# EasyEDA schematic SCH_Schema Sensoren_2022-11-04.json
TITLE: Sheet_1; REV: 1.0; Date: 2022-11-04; Sheet: 1/1; Company: Your Company
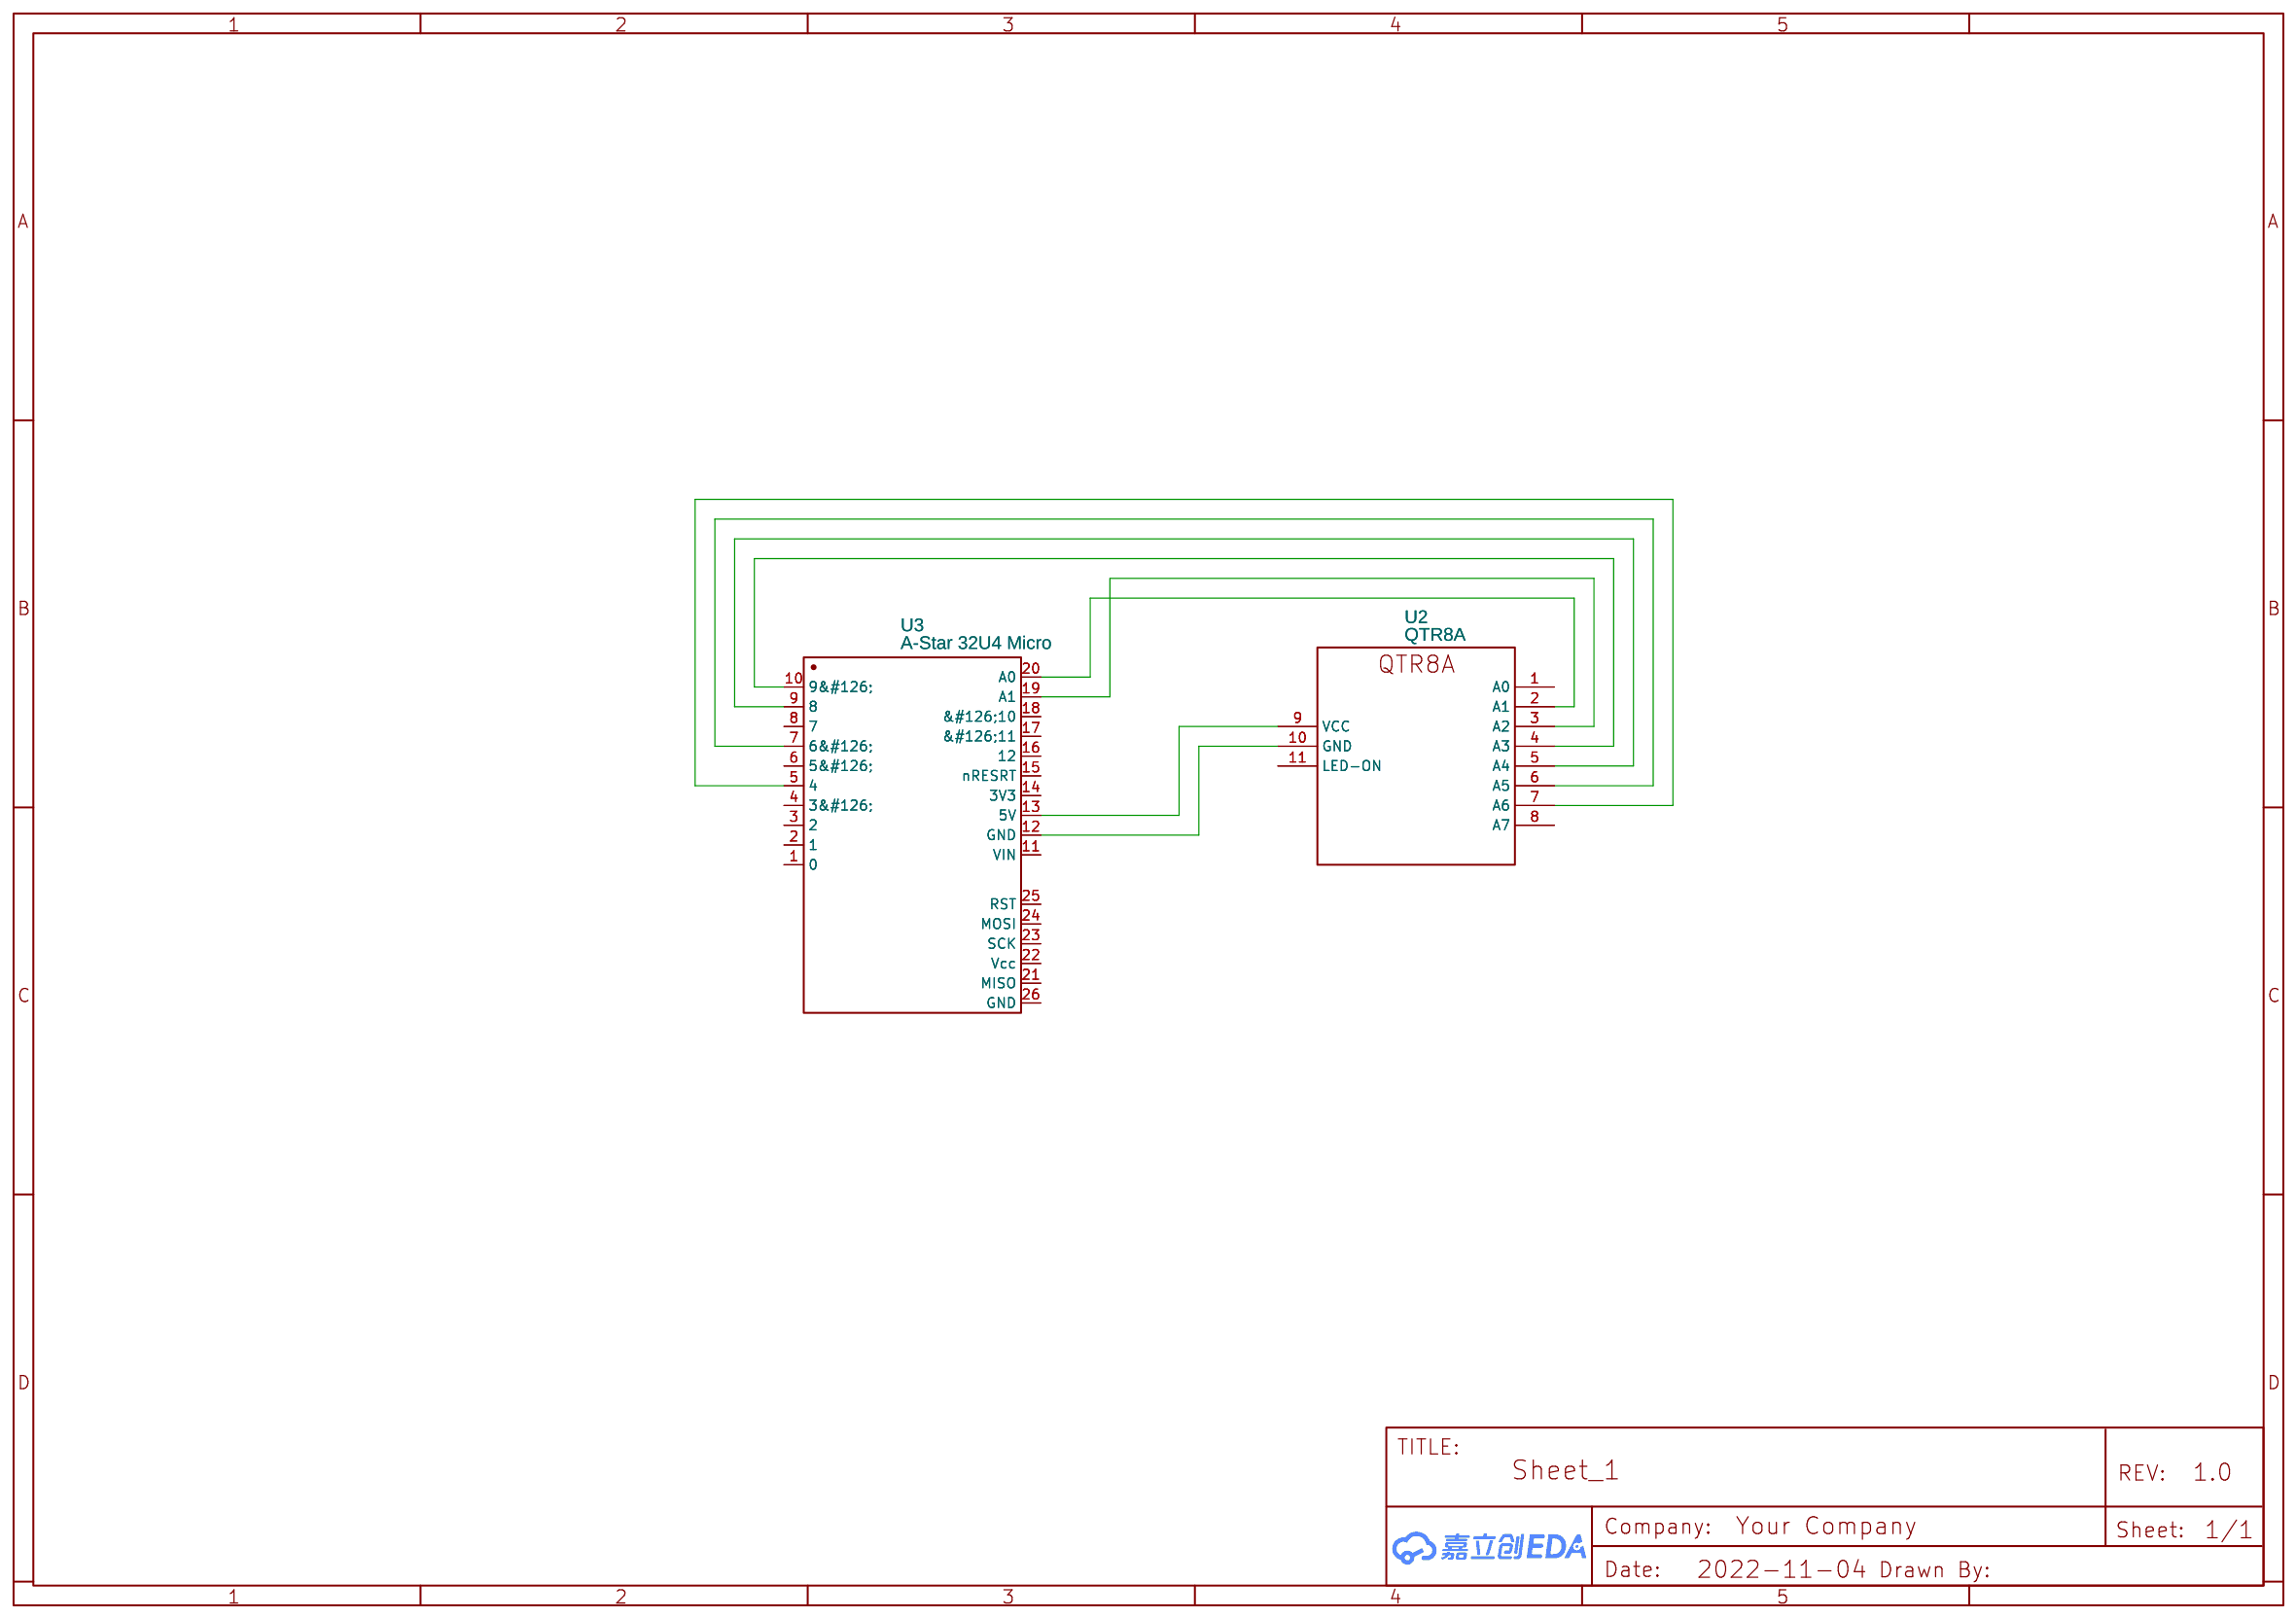
[diagram p0: schematic sheet]

## Parts
U2  QTR8A  [QTR8A]
U3  A-Star 32U4 Micro  [A-STAR 32U4 MICRO]

## Library data of the parts
U2 = QTR8A: Manufacturer: POLOLU; Supplier: POLOLU; link: https://www.pololu.com/product/960/pictures; Contributor: yeison buitrago rojas
U3 = A-Star 32U4 Micro: Manufacturer: pololu; Manufacturer Part: 3101; Supplier: Pololu; link: https://www.4project.co.il/documents/doc_3710_3255.pdf; Contributor: Roi_Doitch

## Nets
Net-(U2-2): U2.2(A1) U3.20(A0)
Net-(U2-3): U2.3(A2) U3.19(A1)
Net-(U2-4): U2.4(A3) U3.10(9&#126;)
Net-(U2-5): U2.5(A4) U3.9(8)
Net-(U2-6): U2.6(A5) U3.7(6&#126;)
Net-(U2-7): U2.7(A6) U3.5(4)
Net-(U2-9): U2.9(VCC) U3.13(5V)
Net-(U2-10): U2.10(GND) U3.12(GND)

Not connected (* = marked no-connect by the designer): U2 1(A0) 8(A7) 11(LED-ON); U3 1(0) 2(1) 3(2) 4(3&#126;) 6(5&#126;) 8(7) 11(VIN) 14(3V3) 15(nRESRT) 16(12) 17(&#126;11) 18(&#126;10) 21(MISO) 22(Vcc) 23(SCK) 24(MOSI) 25(RST) 26(GND)
